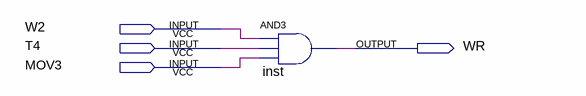
[diagram p0: schematic sheet]
// Quartus schematic WR.bdf as structural Verilog: 1 symbols, 4 pins
module WR (
  input  W2,
  input  T4,
  input  MOV3,
  output WR
);

  and inst (WR, W2, T4, MOV3);
endmodule
